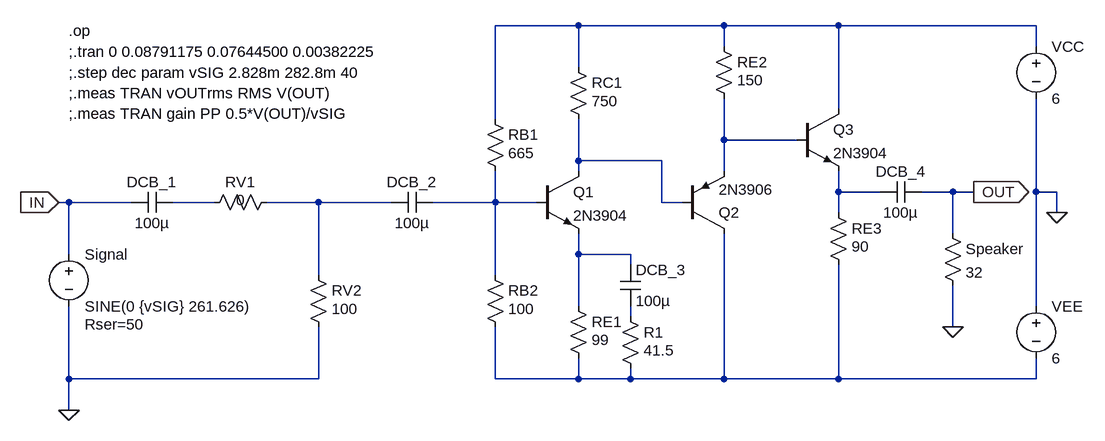
[diagram p0: schematic AudioAmplifier.asc]
AudioAmplifier.asc, the LTspice schematic file:
Version 4
SHEET 1 2440 680
WIRE 528 -304 400 -304
WIRE 752 -304 528 -304
WIRE 928 -304 752 -304
WIRE 1232 -304 928 -304
WIRE 752 -272 752 -304
WIRE 1232 -272 1232 -304
WIRE 528 -240 528 -304
WIRE 928 -176 928 -304
WIRE 400 -160 400 -304
WIRE 752 -128 752 -192
WIRE 864 -128 752 -128
WIRE 528 -96 528 -160
WIRE 656 -96 528 -96
WIRE 528 -80 528 -96
WIRE 752 -80 752 -128
WIRE 928 -48 928 -80
WIRE 992 -48 928 -48
WIRE 1104 -48 1056 -48
WIRE 1136 -48 1104 -48
WIRE 1232 -48 1232 -192
WIRE 1264 -48 1232 -48
WIRE -256 -32 -272 -32
WIRE -160 -32 -256 -32
WIRE -32 -32 -96 -32
WIRE 128 -32 48 -32
WIRE 240 -32 128 -32
WIRE 400 -32 400 -80
WIRE 400 -32 304 -32
WIRE 464 -32 400 -32
WIRE 656 -32 656 -96
WIRE 688 -32 656 -32
WIRE 928 -16 928 -48
WIRE 1264 -16 1264 -48
WIRE 1104 16 1104 -48
WIRE -256 48 -256 -32
WIRE 528 48 528 16
WIRE 608 48 528 48
WIRE 608 64 608 48
WIRE 128 80 128 -32
WIRE 400 80 400 -32
WIRE 528 128 528 48
WIRE 1232 128 1232 -48
WIRE 608 144 608 128
WIRE 1104 160 1104 96
WIRE -256 240 -256 128
WIRE 128 240 128 160
WIRE 128 240 -256 240
WIRE 400 240 400 160
WIRE 528 240 528 208
WIRE 528 240 400 240
WIRE 608 240 608 224
WIRE 608 240 528 240
WIRE 752 240 752 16
WIRE 752 240 608 240
WIRE 928 240 928 64
WIRE 928 240 752 240
WIRE 1232 240 1232 208
WIRE 1232 240 928 240
WIRE -256 288 -256 240
FLAG -256 288 0
FLAG 1136 -48 OUT
IOPIN 1136 -48 Out
FLAG -272 -32 IN
IOPIN -272 -32 In
FLAG 1264 -16 0
FLAG 1104 160 0
SYMBOL voltage 1232 -288 R0
WINDOW 123 0 0 Left 0
WINDOW 39 0 0 Left 0
SYMATTR InstName VCC
SYMATTR Value 6
SYMBOL cap 304 -48 R90
WINDOW 0 0 32 VBottom 2
WINDOW 3 32 32 VTop 2
SYMATTR InstName DCB_2
SYMATTR Value 100µ
SYMBOL res 384 -176 R0
WINDOW 3 36 68 Left 2
SYMATTR Value 665
SYMATTR InstName RB1
SYMBOL res 384 64 R0
WINDOW 3 36 68 Left 2
SYMATTR Value 100
SYMATTR InstName RB2
SYMBOL res 912 -32 R0
WINDOW 3 36 68 Left 2
SYMATTR Value 90
SYMATTR InstName RE3
SYMBOL res 1088 0 R0
SYMATTR InstName Speaker
SYMATTR Value 32
SYMBOL voltage -256 32 R0
WINDOW 123 0 0 Left 2
WINDOW 39 24 124 Left 2
SYMATTR SpiceLine Rser=50
SYMATTR InstName Signal
SYMATTR Value SINE(0 {vSIG} 261.626)
SYMBOL cap 1056 -64 R90
WINDOW 0 0 32 VBottom 2
WINDOW 3 32 32 VTop 2
SYMATTR InstName DCB_4
SYMATTR Value 100µ
SYMBOL res 112 64 R0
WINDOW 3 36 68 Left 2
SYMATTR Value 100
SYMATTR InstName RV2
SYMBOL res 64 -48 R90
WINDOW 0 0 56 VBottom 2
WINDOW 3 28 56 VBottom 2
SYMATTR InstName RV1
SYMATTR Value 0
SYMBOL cap -96 -48 R90
WINDOW 0 0 32 VBottom 2
WINDOW 3 32 32 VTop 2
SYMATTR InstName DCB_1
SYMATTR Value 100µ
SYMBOL res 512 112 R0
WINDOW 3 36 68 Left 2
SYMATTR Value 99
SYMATTR InstName RE1
SYMBOL res 592 128 R0
WINDOW 3 36 68 Left 2
SYMATTR Value 41.5
SYMATTR InstName R1
SYMBOL cap 592 64 R0
SYMATTR InstName DCB_3
SYMATTR Value 100µ
SYMBOL res 512 -256 R0
WINDOW 3 36 68 Left 2
SYMATTR Value 750
SYMATTR InstName RC1
SYMBOL res 736 -288 R0
WINDOW 3 36 68 Left 2
SYMATTR Value 150
SYMATTR InstName RE2
SYMBOL npn 464 -80 R0
SYMATTR InstName Q1
SYMATTR Value 2N3904
SYMBOL npn 864 -176 R0
SYMATTR InstName Q3
SYMATTR Value 2N3904
SYMBOL pnp 688 16 M180
SYMATTR InstName Q2
SYMATTR Value 2N3906
SYMBOL voltage 1232 112 R0
WINDOW 123 0 0 Left 0
WINDOW 39 0 0 Left 0
SYMATTR InstName VEE
SYMATTR Value 6
TEXT -256 -232 Left 2 !;.step dec param vSIG 2.828m 282.8m 40
TEXT -256 -264 Left 2 !;.tran 0 0.08791175 0.07644500 0.00382225
TEXT -256 -200 Left 2 !;.meas TRAN vOUTrms RMS V(OUT)\n;.meas TRAN gain PP 0.5*V(OUT)/vSIG
TEXT -256 -296 Left 2 !.op

The netlist it stands for:
* AudioAmplifier.asc
VCC N001 0 6
C§DCB_2 N007 N006 100µ
RB1 N001 N007 665
RB2 N007 N010 100
RE3 N004 N010 90
R§Speaker OUT 0 32
V§Signal IN 0 SINE(0 {vSIG} 261.626) Rser=50
C§DCB_4 OUT N004 100µ
RV2 N006 0 100
RV1 N006 N005 0
C§DCB_1 N005 IN 100µ
RE1 N008 N010 99
R1 N009 N010 41.5
C§DCB_3 N008 N009 100µ
RC1 N001 N003 750
RE2 N001 N002 150
Q1 N003 N007 N008 0 2N3904
Q3 N001 N002 N004 0 2N3904
Q2 N010 N003 N002 0 2N3906
VEE 0 N010 6
.model NPN NPN
.model PNP PNP
.lib standard.bjt
;.step dec param vSIG 2.828m 282.8m 40
;.tran 0 0.08791175 0.07644500 0.00382225
;.meas TRAN vOUTrms RMS V(OUT)
;.meas TRAN gain PP 0.5*V(OUT)/vSIG
.op
.backanno
.end